# EasyEDA schematic SCH_LOWCURRENT_LD293D_DRIVER_2026-05-30.json
TITLE: Sheet_1; REV: 1.0; Date: 2026-05-07; Sheet: 1/1; Drawn By: Lorenzosdv; Company: Your Company
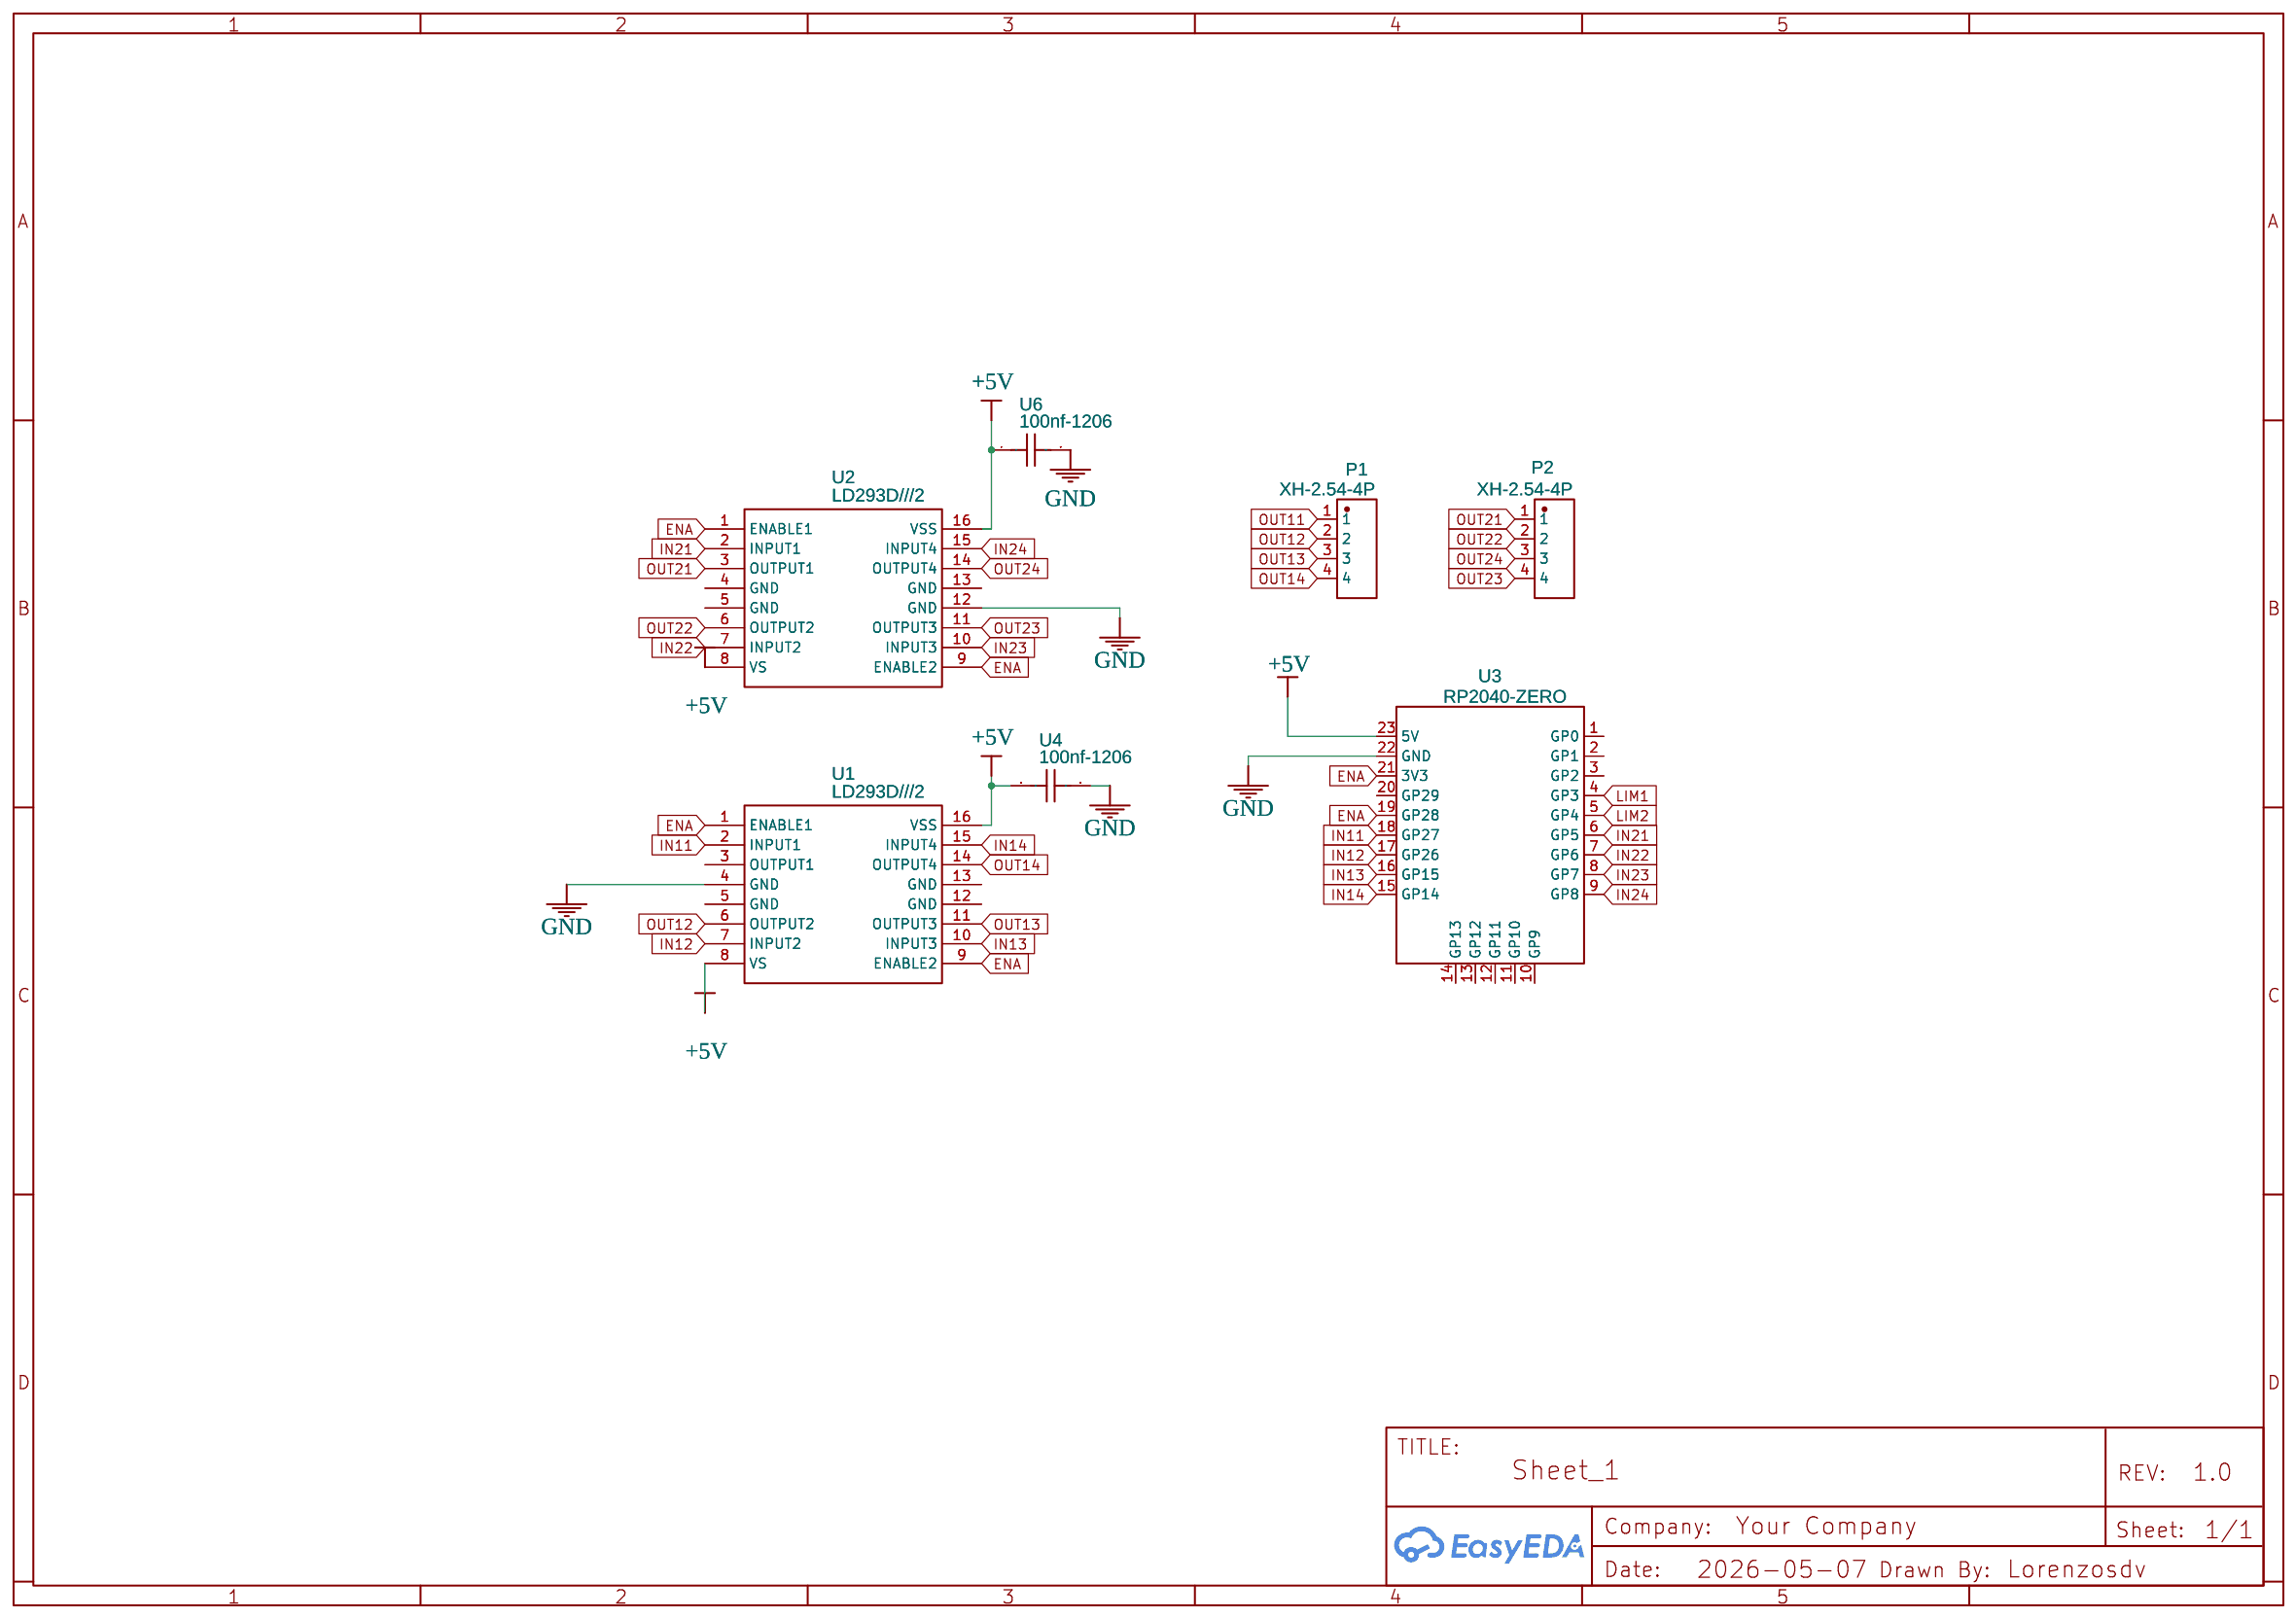
[diagram p0: schematic sheet]

## Parts
P1  XH-2.54-4P  [CONN-TH_4P-P2.50-XH2.54-4P]
P2  XH-2.54-4P  [CONN-TH_4P-P2.50-XH2.54-4P]
U1  LD293D///2  [DIP-16_L20.0-W6.4-P2.54-LS7.6-BL]
U2  LD293D///2  [DIP-16_L20.0-W6.4-P2.54-LS7.6-BL]
U3  RP2040-ZERO  [COMM-SMD_RP2040-ZERO]
U4  100nf-1206  [C1206]
U6  100nf-1206  [C1206]

## Library data of the parts
P1 P2 = XH-2.54-4P: Contributor: LCSC; Supplier: LCSC; Supplier Part: C9900003933; Manufacturer: null; JLCPCB Part Class: Extended Part
U1 U2 = LD293D///2: Contributor: mochariyan.23238; Supplier: LCSC; Manufacturer: STMicroelectronics; Manufacturer Part: L293D; Supplier Part: C12340; JLCPCB Part Class: Extended Part
U3 = RP2040-ZERO: Supplier: LCSC; Supplier Part: C5350143; Manufacturer: Waveshare(微雪电子); Manufacturer Part: RP2040-Zero; Contributor: lcsc; JLCPCB Part Class: Extended Part
U4 U6 = 220UF-1206: Contributor: LCSC; Supplier: LCSC; Supplier Part: C9900012040; Manufacturer: null; JLCPCB Part Class: Extended Part

## Nets
+5V: U1.8(VS) U1.16(VSS) U2.8(VS) U2.16(VSS) U3.23(5V) U4.1 U6.1
GND: U1.4(GND) U2.12(GND) U3.22(GND) U4.2 U6.2
ENA: U1.1(ENABLE1) U1.9(ENABLE2) U2.1(ENABLE1) U2.9(ENABLE2) U3.19(GP28) U3.21(3V3)
IN11: U1.2(INPUT1) U3.18(GP27)
IN12: U1.7(INPUT2) U3.17(GP26)
IN13: U1.10(INPUT3) U3.16(GP15)
IN14: U1.15(INPUT4) U3.15(GP14)
IN21: U2.2(INPUT1) U3.6(GP5)
IN22: U2.7(INPUT2) U3.7(GP6)
IN23: U2.10(INPUT3) U3.8(GP7)
IN24: U2.15(INPUT4) U3.9(GP8)
LIM1: U3.4(GP3)
LIM2: U3.5(GP4)
OUT11: P1.1
OUT12: P1.2 U1.6(OUTPUT2)
OUT13: P1.3 U1.11(OUTPUT3)
OUT14: P1.4 U1.14(OUTPUT4)
OUT21: P2.1 U2.3(OUTPUT1)
OUT22: P2.2 U2.6(OUTPUT2)
OUT23: P2.4 U2.11(OUTPUT3)
OUT24: P2.3 U2.14(OUTPUT4)

Not connected (* = marked no-connect by the designer): U1 3(OUTPUT1) 5(GND) 12(GND) 13(GND); U2 4(GND) 5(GND) 13(GND); U3 1(GP0) 2(GP1) 3(GP2) 10(GP9) 11(GP10) 12(GP11) 13(GP12) 14(GP13) 20(GP29)
